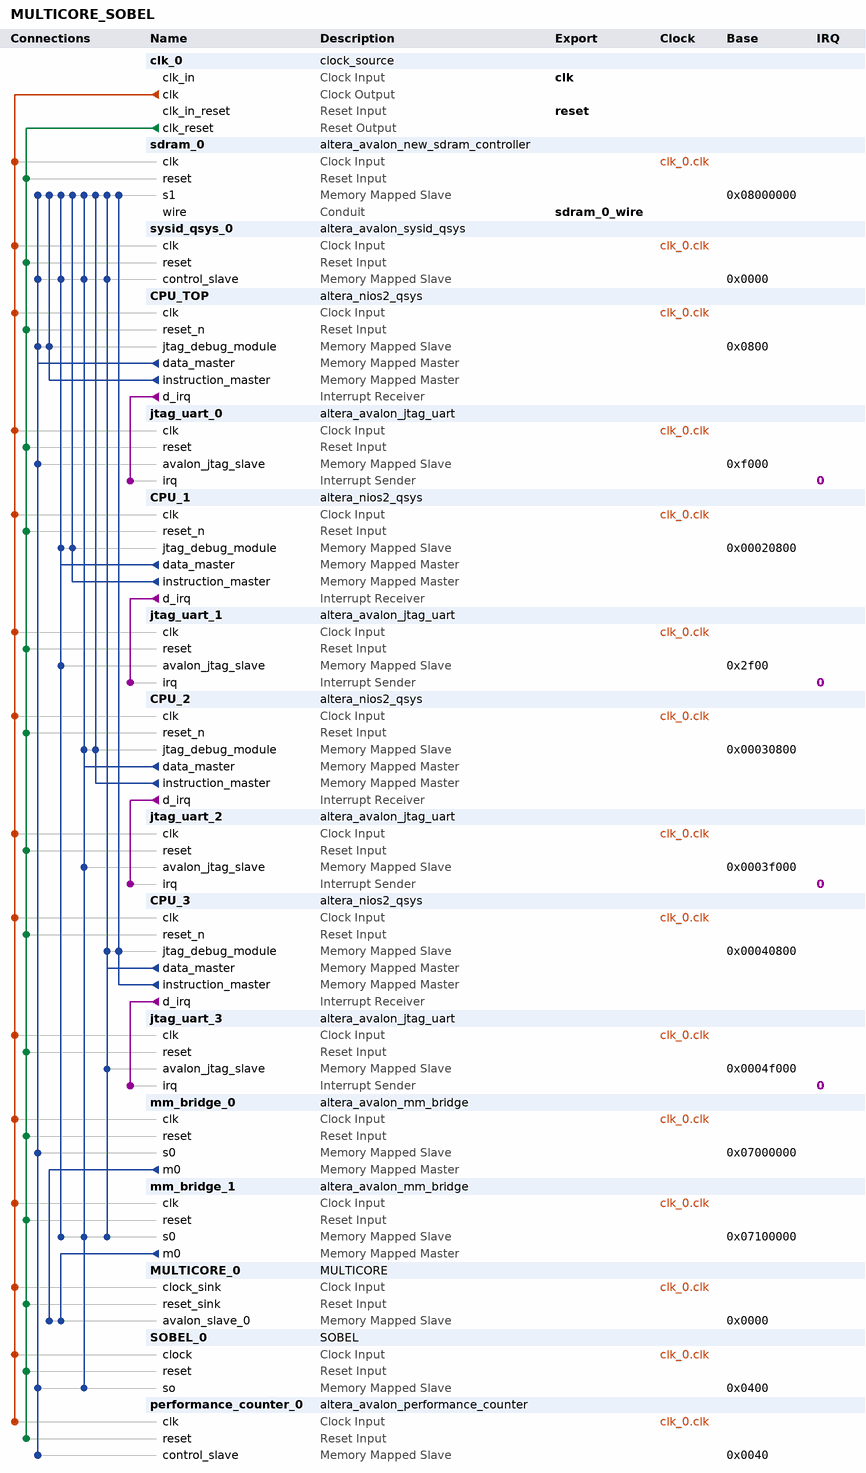
[diagram p0: system contents]
# Platform Designer (Qsys) system MULTICORE_SOBEL, Cyclone IV E EP4CE115F29C7
# Parameters at their usual value, and those the tool derives, are not listed.
package require -exact qsys 12.1
create_system MULTICORE_SOBEL
set_project_property DEVICE_FAMILY {Cyclone IV E}
set_project_property DEVICE EP4CE115F29C7

add_instance clk_0 clock_source 12.1
set_instance_parameter_value clk_0 clockFrequency 50000000

add_instance sdram_0 altera_avalon_new_sdram_controller 12.1
set_instance_parameter_value sdram_0 TAC 3.75
set_instance_parameter_value sdram_0 TRCD 20.0
set_instance_parameter_value sdram_0 TRP 20.0
set_instance_parameter_value sdram_0 casLatency 3
set_instance_parameter_value sdram_0 columnWidth 10
set_instance_parameter_value sdram_0 dataWidth 32
set_instance_parameter_value sdram_0 generateSimulationModel false
set_instance_parameter_value sdram_0 model custom
set_instance_parameter_value sdram_0 numberOfBanks 4
set_instance_parameter_value sdram_0 numberOfChipSelects 1
set_instance_parameter_value sdram_0 powerUpDelay 200.0
set_instance_parameter_value sdram_0 refreshPeriod 7.1825
set_instance_parameter_value sdram_0 rowWidth 13

add_instance sysid_qsys_0 altera_avalon_sysid_qsys 12.1
set_instance_parameter_value sysid_qsys_0 id 0

add_instance CPU_TOP altera_nios2_qsys 12.1
set_instance_parameter_value CPU_TOP resetOffset 67108864
set_instance_parameter_value CPU_TOP exceptionOffset 67108896
set_instance_parameter_value CPU_TOP resetSlave sdram_0.s1
set_instance_parameter_value CPU_TOP exceptionSlave sdram_0.s1
set_instance_parameter_value CPU_TOP breakSlave CPU_TOP.jtag_debug_module
set_instance_parameter_value CPU_TOP impl Tiny
set_instance_parameter_value CPU_TOP icache_size 4096

add_instance jtag_uart_0 altera_avalon_jtag_uart 12.1
set_instance_parameter_value jtag_uart_0 simInteractiveOptions INTERACTIVE_ASCII_OUTPUT

add_instance CPU_1 altera_nios2_qsys 12.1
set_instance_parameter_value CPU_1 resetOffset 50331648
set_instance_parameter_value CPU_1 exceptionOffset 50331680
set_instance_parameter_value CPU_1 resetSlave sdram_0.s1
set_instance_parameter_value CPU_1 exceptionSlave sdram_0.s1
set_instance_parameter_value CPU_1 breakSlave CPU_1.jtag_debug_module
set_instance_parameter_value CPU_1 impl Tiny
set_instance_parameter_value CPU_1 icache_size 4096

add_instance jtag_uart_1 altera_avalon_jtag_uart 12.1
set_instance_parameter_value jtag_uart_1 simInteractiveOptions INTERACTIVE_ASCII_OUTPUT

add_instance CPU_2 altera_nios2_qsys 12.1
set_instance_parameter_value CPU_2 resetOffset 31457280
set_instance_parameter_value CPU_2 exceptionOffset 31457312
set_instance_parameter_value CPU_2 resetSlave sdram_0.s1
set_instance_parameter_value CPU_2 exceptionSlave sdram_0.s1
set_instance_parameter_value CPU_2 breakSlave CPU_2.jtag_debug_module
set_instance_parameter_value CPU_2 impl Tiny
set_instance_parameter_value CPU_2 icache_size 4096

add_instance jtag_uart_2 altera_avalon_jtag_uart 12.1
set_instance_parameter_value jtag_uart_2 simInteractiveOptions INTERACTIVE_ASCII_OUTPUT

add_instance CPU_3 altera_nios2_qsys 12.1
set_instance_parameter_value CPU_3 resetSlave sdram_0.s1
set_instance_parameter_value CPU_3 exceptionSlave sdram_0.s1
set_instance_parameter_value CPU_3 breakSlave CPU_3.jtag_debug_module
set_instance_parameter_value CPU_3 impl Tiny
set_instance_parameter_value CPU_3 icache_size 4096

add_instance jtag_uart_3 altera_avalon_jtag_uart 12.1
set_instance_parameter_value jtag_uart_3 simInteractiveOptions INTERACTIVE_ASCII_OUTPUT

add_instance mm_bridge_0 altera_avalon_mm_bridge 12.1
set_instance_parameter_value mm_bridge_0 DATA_WIDTH 32
set_instance_parameter_value mm_bridge_0 ADDRESS_WIDTH 10
set_instance_parameter_value mm_bridge_0 ADDRESS_UNITS SYMBOLS
set_instance_parameter_value mm_bridge_0 MAX_PENDING_RESPONSES 4

add_instance mm_bridge_1 altera_avalon_mm_bridge 12.1
set_instance_parameter_value mm_bridge_1 DATA_WIDTH 32
set_instance_parameter_value mm_bridge_1 ADDRESS_WIDTH 10
set_instance_parameter_value mm_bridge_1 ADDRESS_UNITS SYMBOLS
set_instance_parameter_value mm_bridge_1 MAX_PENDING_RESPONSES 4

add_instance MULTICORE_0 MULTICORE 1.0
set_instance_parameter_value MULTICORE_0 daughter_processors 3

add_instance SOBEL_0 SOBEL 1.0

add_instance performance_counter_0 altera_avalon_performance_counter 12.1
set_instance_parameter_value performance_counter_0 numberOfSections 3

# connections
add_connection clk_0.clk CPU_1.clk clock
add_connection clk_0.clk CPU_2.clk clock
add_connection clk_0.clk CPU_3.clk clock
add_connection clk_0.clk CPU_TOP.clk clock
add_connection clk_0.clk jtag_uart_0.clk clock
add_connection clk_0.clk jtag_uart_1.clk clock
add_connection clk_0.clk jtag_uart_2.clk clock
add_connection clk_0.clk jtag_uart_3.clk clock
add_connection clk_0.clk mm_bridge_0.clk clock
add_connection clk_0.clk mm_bridge_1.clk clock
add_connection clk_0.clk MULTICORE_0.clock_sink clock
add_connection clk_0.clk performance_counter_0.clk clock
add_connection clk_0.clk sdram_0.clk clock
add_connection clk_0.clk SOBEL_0.clock clock
add_connection clk_0.clk sysid_qsys_0.clk clock
add_connection clk_0.clk_reset CPU_1.reset_n reset
add_connection clk_0.clk_reset CPU_2.reset_n reset
add_connection clk_0.clk_reset CPU_3.reset_n reset
add_connection clk_0.clk_reset CPU_TOP.reset_n reset
add_connection clk_0.clk_reset jtag_uart_0.reset reset
add_connection clk_0.clk_reset jtag_uart_1.reset reset
add_connection clk_0.clk_reset jtag_uart_2.reset reset
add_connection clk_0.clk_reset jtag_uart_3.reset reset
add_connection clk_0.clk_reset mm_bridge_0.reset reset
add_connection clk_0.clk_reset mm_bridge_1.reset reset
add_connection clk_0.clk_reset MULTICORE_0.reset_sink reset
add_connection clk_0.clk_reset performance_counter_0.reset reset
add_connection clk_0.clk_reset sdram_0.reset reset
add_connection clk_0.clk_reset SOBEL_0.reset reset
add_connection clk_0.clk_reset sysid_qsys_0.reset reset
add_connection CPU_1.data_master CPU_1.jtag_debug_module avalon
set_connection_parameter_value CPU_1.data_master/CPU_1.jtag_debug_module baseAddress 0x00020800
add_connection CPU_1.data_master jtag_uart_1.avalon_jtag_slave avalon
set_connection_parameter_value CPU_1.data_master/jtag_uart_1.avalon_jtag_slave baseAddress 0x2f00
add_connection CPU_1.data_master mm_bridge_1.s0 avalon
set_connection_parameter_value CPU_1.data_master/mm_bridge_1.s0 baseAddress 0x07100000
add_connection CPU_1.data_master sdram_0.s1 avalon
set_connection_parameter_value CPU_1.data_master/sdram_0.s1 baseAddress 0x08000000
add_connection CPU_1.data_master sysid_qsys_0.control_slave avalon
set_connection_parameter_value CPU_1.data_master/sysid_qsys_0.control_slave baseAddress 0x0000
add_connection CPU_1.instruction_master CPU_1.jtag_debug_module avalon
set_connection_parameter_value CPU_1.instruction_master/CPU_1.jtag_debug_module baseAddress 0x00020800
add_connection CPU_1.instruction_master sdram_0.s1 avalon
set_connection_parameter_value CPU_1.instruction_master/sdram_0.s1 baseAddress 0x08000000
add_connection CPU_2.data_master CPU_2.jtag_debug_module avalon
set_connection_parameter_value CPU_2.data_master/CPU_2.jtag_debug_module baseAddress 0x00030800
add_connection CPU_2.data_master jtag_uart_2.avalon_jtag_slave avalon
set_connection_parameter_value CPU_2.data_master/jtag_uart_2.avalon_jtag_slave baseAddress 0x0003f000
add_connection CPU_2.data_master mm_bridge_1.s0 avalon
set_connection_parameter_value CPU_2.data_master/mm_bridge_1.s0 baseAddress 0x07100000
add_connection CPU_2.data_master sdram_0.s1 avalon
set_connection_parameter_value CPU_2.data_master/sdram_0.s1 baseAddress 0x08000000
add_connection CPU_2.data_master SOBEL_0.so avalon
set_connection_parameter_value CPU_2.data_master/SOBEL_0.so baseAddress 0x0400
add_connection CPU_2.data_master sysid_qsys_0.control_slave avalon
set_connection_parameter_value CPU_2.data_master/sysid_qsys_0.control_slave baseAddress 0x0000
add_connection CPU_2.instruction_master CPU_2.jtag_debug_module avalon
set_connection_parameter_value CPU_2.instruction_master/CPU_2.jtag_debug_module baseAddress 0x00030800
add_connection CPU_2.instruction_master sdram_0.s1 avalon
set_connection_parameter_value CPU_2.instruction_master/sdram_0.s1 baseAddress 0x08000000
add_connection CPU_3.data_master CPU_3.jtag_debug_module avalon
set_connection_parameter_value CPU_3.data_master/CPU_3.jtag_debug_module baseAddress 0x00040800
add_connection CPU_3.data_master jtag_uart_3.avalon_jtag_slave avalon
set_connection_parameter_value CPU_3.data_master/jtag_uart_3.avalon_jtag_slave baseAddress 0x0004f000
add_connection CPU_3.data_master mm_bridge_1.s0 avalon
set_connection_parameter_value CPU_3.data_master/mm_bridge_1.s0 baseAddress 0x07100000
add_connection CPU_3.data_master sdram_0.s1 avalon
set_connection_parameter_value CPU_3.data_master/sdram_0.s1 baseAddress 0x08000000
add_connection CPU_3.data_master sysid_qsys_0.control_slave avalon
set_connection_parameter_value CPU_3.data_master/sysid_qsys_0.control_slave baseAddress 0x0000
add_connection CPU_3.instruction_master CPU_3.jtag_debug_module avalon
set_connection_parameter_value CPU_3.instruction_master/CPU_3.jtag_debug_module baseAddress 0x00040800
add_connection CPU_3.instruction_master sdram_0.s1 avalon
set_connection_parameter_value CPU_3.instruction_master/sdram_0.s1 baseAddress 0x08000000
add_connection CPU_TOP.data_master CPU_TOP.jtag_debug_module avalon
set_connection_parameter_value CPU_TOP.data_master/CPU_TOP.jtag_debug_module baseAddress 0x0800
add_connection CPU_TOP.data_master jtag_uart_0.avalon_jtag_slave avalon
set_connection_parameter_value CPU_TOP.data_master/jtag_uart_0.avalon_jtag_slave baseAddress 0xf000
add_connection CPU_TOP.data_master mm_bridge_0.s0 avalon
set_connection_parameter_value CPU_TOP.data_master/mm_bridge_0.s0 baseAddress 0x07000000
add_connection CPU_TOP.data_master performance_counter_0.control_slave avalon
set_connection_parameter_value CPU_TOP.data_master/performance_counter_0.control_slave baseAddress 0x0040
add_connection CPU_TOP.data_master sdram_0.s1 avalon
set_connection_parameter_value CPU_TOP.data_master/sdram_0.s1 baseAddress 0x08000000
add_connection CPU_TOP.data_master SOBEL_0.so avalon
set_connection_parameter_value CPU_TOP.data_master/SOBEL_0.so baseAddress 0x0400
add_connection CPU_TOP.data_master sysid_qsys_0.control_slave avalon
set_connection_parameter_value CPU_TOP.data_master/sysid_qsys_0.control_slave baseAddress 0x0000
add_connection CPU_TOP.instruction_master CPU_TOP.jtag_debug_module avalon
set_connection_parameter_value CPU_TOP.instruction_master/CPU_TOP.jtag_debug_module baseAddress 0x0800
add_connection CPU_TOP.instruction_master sdram_0.s1 avalon
set_connection_parameter_value CPU_TOP.instruction_master/sdram_0.s1 baseAddress 0x08000000
add_connection mm_bridge_0.m0 MULTICORE_0.avalon_slave_0 avalon
set_connection_parameter_value mm_bridge_0.m0/MULTICORE_0.avalon_slave_0 baseAddress 0x0000
add_connection mm_bridge_1.m0 MULTICORE_0.avalon_slave_0 avalon
set_connection_parameter_value mm_bridge_1.m0/MULTICORE_0.avalon_slave_0 baseAddress 0x0000
add_connection CPU_1.d_irq jtag_uart_1.irq interrupt
set_connection_parameter_value CPU_1.d_irq/jtag_uart_1.irq irqNumber 0
add_connection CPU_2.d_irq jtag_uart_2.irq interrupt
set_connection_parameter_value CPU_2.d_irq/jtag_uart_2.irq irqNumber 0
add_connection CPU_3.d_irq jtag_uart_3.irq interrupt
set_connection_parameter_value CPU_3.d_irq/jtag_uart_3.irq irqNumber 0
add_connection CPU_TOP.d_irq jtag_uart_0.irq interrupt
set_connection_parameter_value CPU_TOP.d_irq/jtag_uart_0.irq irqNumber 0

# exported interfaces
add_interface clk clock sink
set_interface_property clk EXPORT_OF clk_0.clk_in
add_interface reset reset sink
set_interface_property reset EXPORT_OF clk_0.clk_in_reset
add_interface sdram_0_wire conduit end
set_interface_property sdram_0_wire EXPORT_OF sdram_0.wire

save_system MULTICORE_SOBEL.qsys
